# EAGLE design Main (EAGLE 8.3.0)
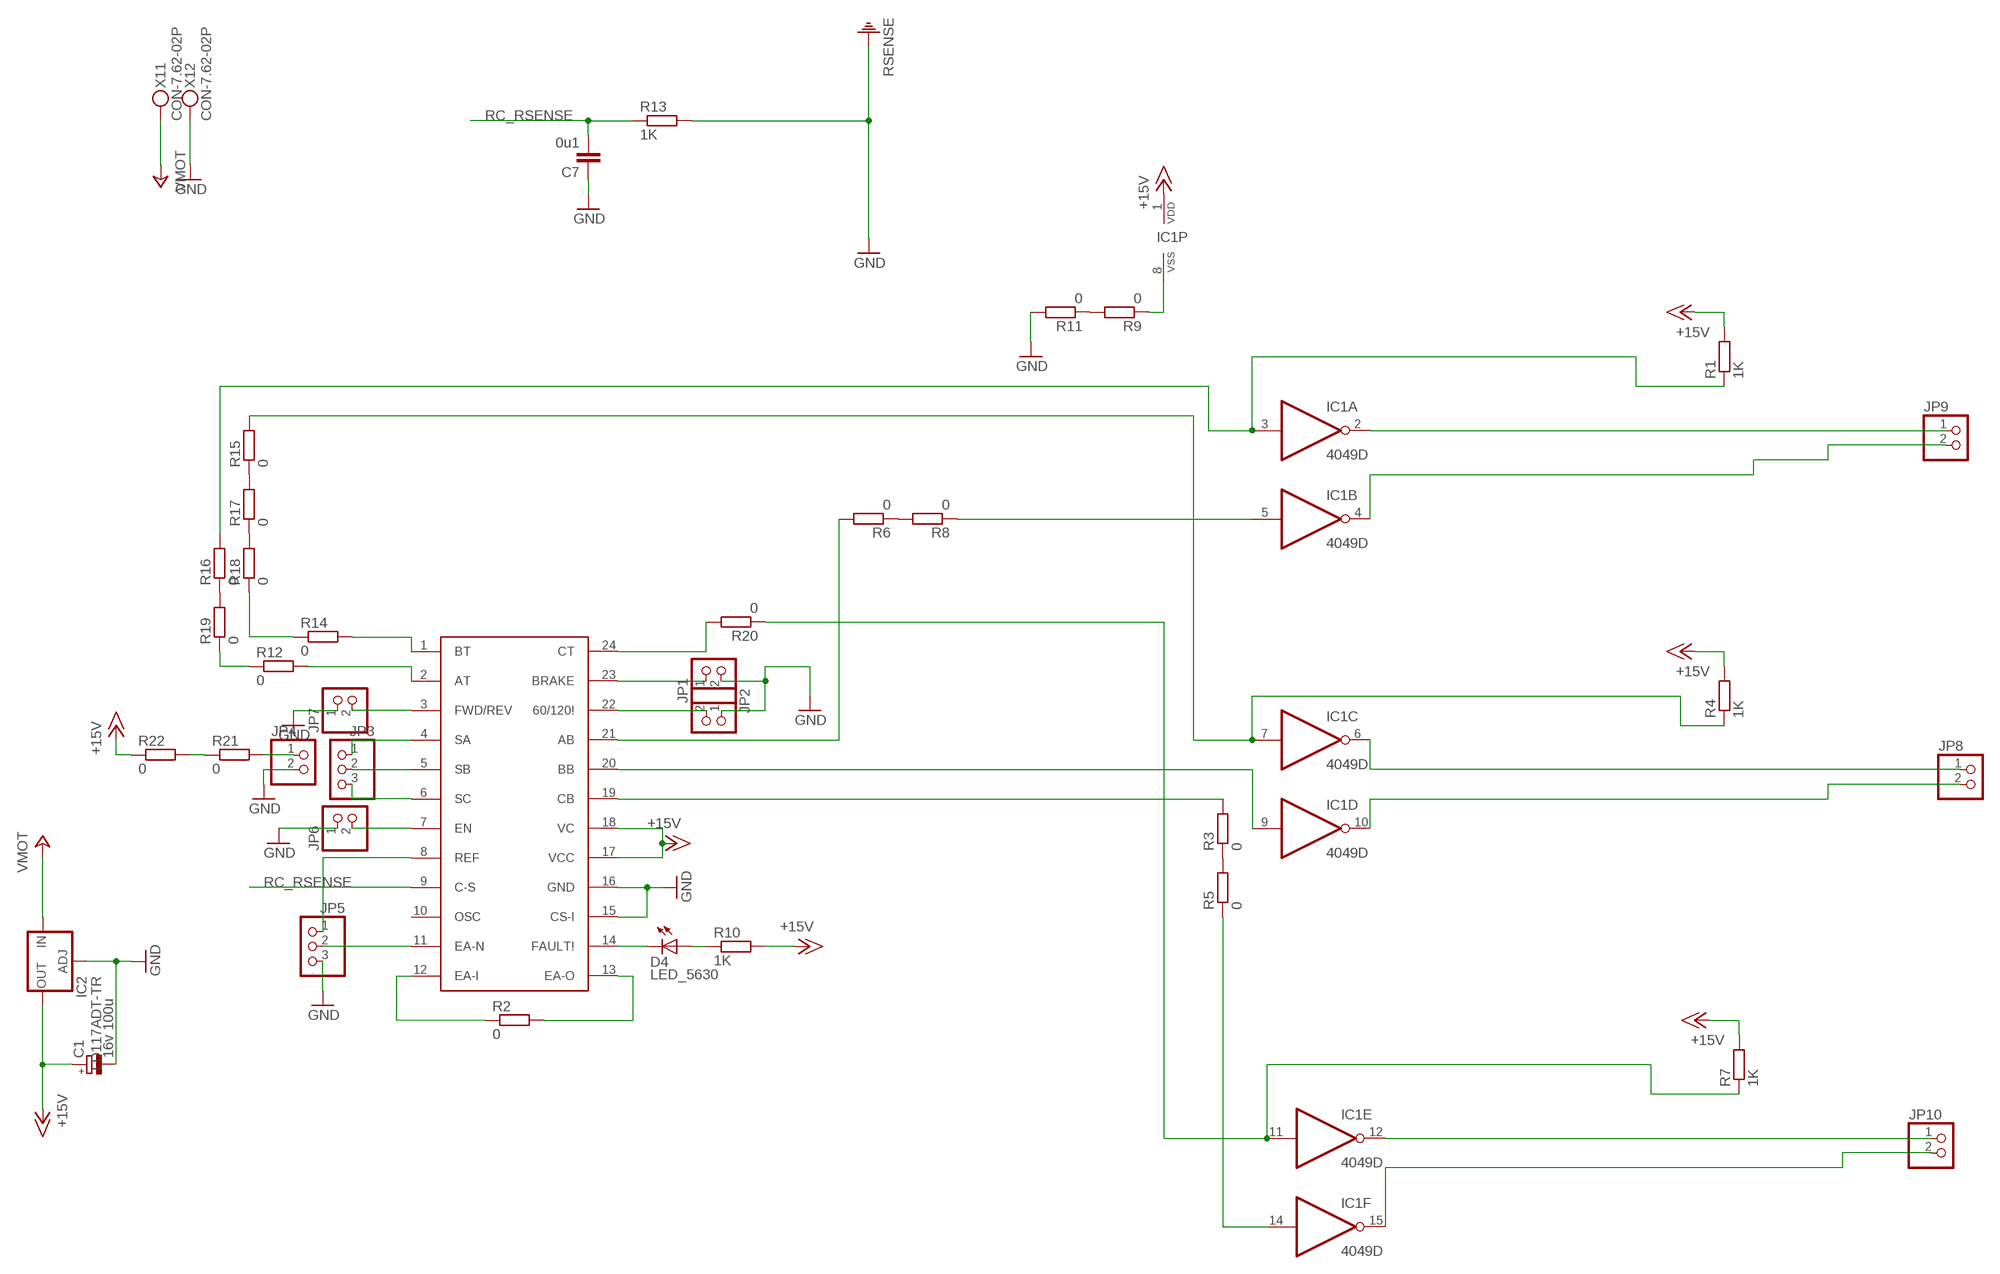
[diagram p0: schematic, sheet 1]

## Parts
C1  16v 100u  CPOL-EUE2.5-7  [E2,5-7]
C7  0u1  CAP_0805  [C0805]
D4  LED_5630  [LED5730]
IC1  4049D  [SO16]
IC2  LD117ADT-TR  [DPACK]
JP1  PINHD-1X2  [1X02]
JP2  PINHD-1X2  [1X02]
JP3  PINHD-1X3  [1X03]
JP4  PINHD-1X2  [1X02]
JP5  PINHD-1X3  [1X03]
JP6  PINHD-1X2  [1X02]
JP7  PINHD-1X2  [1X02]
JP8  PINHD-1X2  [1X02]
JP9  PINHD-1X2  [1X02]
JP10  PINHD-1X2  [1X02]
R1  1K  R_0805  [R0805]
R2  0  R_0805  [R0805]
R3  0  R_0805  [R0805]
R4  1K  R_0805  [R0805]
R5  0  R_0805  [R0805]
R6  0  R_0805  [R0805]
R7  1K  R_0805  [R0805]
R8  0  R_0805  [R0805]
R9  0  R_1206  [R1206]
R10  1K  R_0805  [R0805]
R11  0  R_0805  [R0805]
R12  0  R_0805  [R0805]
R13  1K  R_0805  [R0805]
R14  0  R_0805  [R0805]
R15  0  R_0805  [R0805]
R16  0  R_0805  [R0805]
R17  0  R_0805  [R0805]
R18  0  R_0805  [R0805]
R19  0  R_0805  [R0805]
R20  0  R_0805  [R0805]
R21  0  R_0805  [R0805]
R22  0  R_0805  [R0805]
U$1  IC-MC33035-D  [SO24W]
X1  CON-7.62-02P  [KF25C-7.62-02P-13]

## Nets
+15V: C1.+ IC1.1(P:VDD) IC2.4(OUT) R1.2 R4.2 R7.2 R10.2 R22.1 U$1.17(VCC) U$1.18(VC)
+24V: IC2.3(IN) X1.P$1 ; supply symbol labelled VMOT
GND: C1.- C7.1 IC2.1(ADJ) JP1.2 JP2.1 JP4.2 JP5.3 JP6.1 JP7.1 R11.2 R13.2 U$1.15(CS-I) U$1.16(GND) X1.P$2 ; supply symbol labelled RSENSE
N$1: R2.2 U$1.13(EA-O)
N$2: IC1.14(F:I) R5.1
N$3: IC1.2(A:O) JP9.1
N$4: IC1.4(B:O) JP9.2
N$5: R3.1 R5.2
N$6: R6.1 R8.2
N$7: IC1.5(B:I) R8.1
N$8: R9.2 R11.1
N$9: IC1.6(C:O) JP8.1
N$10: IC1.10(D:O) JP8.2
N$11: IC1.8(P:VSS) R9.1
N$12: R14.2 U$1.1(BT)
N$13: R12.2 U$1.2(AT)
N$14: R14.1 R18.1
N$15: IC1.12(E:O) JP10.1
N$16: IC1.15(F:O) JP10.2
N$17: R12.1 R19.1
N$18: R15.1 R17.2
N$19: IC1.3(A:I) R1.1 R16.2
N$20: IC1.7(C:I) R4.1 R15.2
N$21: IC1.11(E:I) R7.1 R20.1
N$22: JP1.1 U$1.23(BRAKE)
N$23: JP2.2 U$1.22(60/120!)
N$24: R6.2 U$1.21(AB)
N$25: IC1.9(D:I) U$1.20(BB)
N$26: R3.2 U$1.19(CB)
N$27: R17.1 R18.2
N$28: R16.1 R19.2
N$29: R20.2 U$1.24(CT)
N$30: JP4.1 R21.2
N$31: R21.1 R22.2
N$33: JP3.1 U$1.4(SA)
N$34: JP3.2 U$1.5(SB)
N$35: JP3.3 U$1.6(SC)
N$36: R2.1 U$1.12(EA-I)
N$37: JP5.1 U$1.8(REF)
N$38: JP5.2 U$1.11(EA-N)
N$39: JP6.2 U$1.7(EN)
N$40: JP7.2 U$1.3(FWD/REV)
N$41: D4.C U$1.14(FAULT!)
N$42: D4.A D4.A1(A) R10.1
RC_RSENSE: C7.2 R13.1 U$1.9(C-S)
Unconnected: U$1.10(OSC)

## Library data of the parts
C1 = rcl:CPOL-EU: POLARIZED CAPACITOR, European symbol
C7 = Namenlos:CAP_
D4 = Namenlos:LED_
IC1 = 40xx:4049: Hex inverting BUFFER
IC2 = v-reg:LD117A?*: Low drop fixed and adjustable positive voltage regulators 1 A Source: http://www.st.com/stonline/products/literature/ds/7194/ld1117axx.pdf
JP1 JP2 JP4 JP6-JP10 = pinhead:PINHD-1X2: PIN HEADER
JP3 JP5 = pinhead:PINHD-1X3: PIN HEADER
R1-R22 = Namenlos:R_
U$1 = Namenlos:IC-MC33035-D
X1 = Namenlos:CON-7.62-02P

## Board
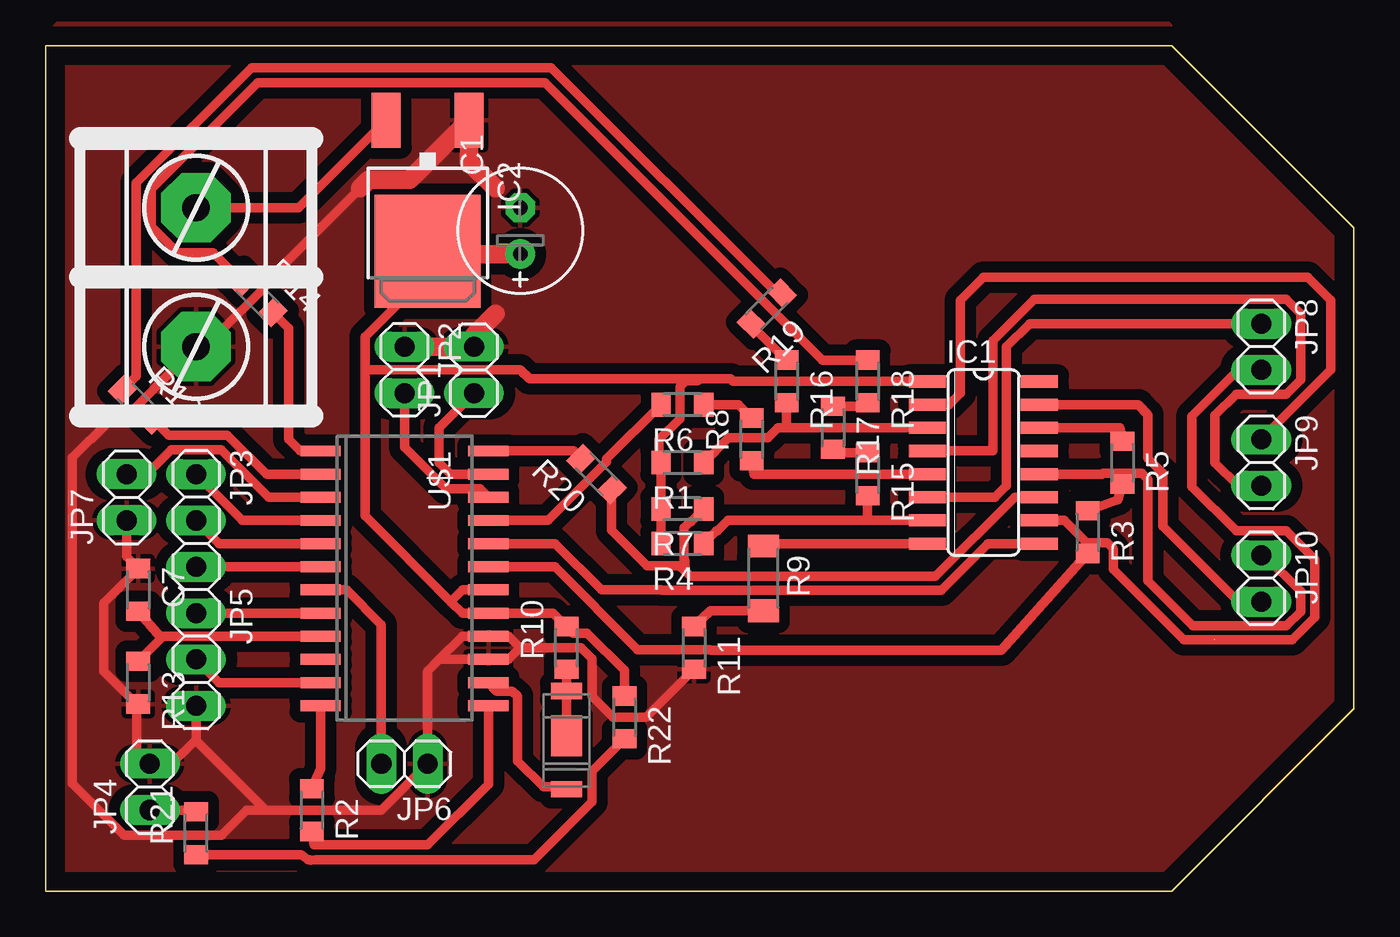
[diagram p1: board, top side]

Size 71.75 x 46.35 mm. Coordinates in mm from the lower left corner, seen from the top.
Outline: 0,46.35 61.75,46.35 71.75,36.35 71.75,10 61.75,0 0,0 0,46.35
Copper layers (1*16): Top 0.035mm / dielectric 1.5mm / Bottom 0.035mm
Design rules "default *": minimum track width 10mil, minimum drill 24mil, track to track 12mil, track to pad 12mil, pad to pad 12mil, via to via 12mil, smd to smd 12mil, copper to edge 40mil, drill to drill 8mil, minimum pad ring 10mil, minimum via ring 8mil, stop-mask expansion 4mil, vias tented up to drill 0mil, thermal gap 10mil

### Footprints (pad centres in the part's own frame; a part is rotated, then mirrored left to right if it is on the bottom)
E2,5-7 = drill 0.813 pad 1.6: + -1.27,0 | drill 0.813 pad 1.6 octagon: - 1.27,0
C0805 = smd 1.05 x 1.3: 1 -1.175,0; 2 1.175,0
LED5730 = smd 0.9 x 1.7: A -2.708,-0.014; C 2.672,-0.014 | smd 2.25 x 1.7: A1 -0.263,-0.014
SO16 = smd 0.66 x 2.032: 1 -4.445,-3.073; 2 -3.175,-3.073; 3 -1.905,-3.073; 4 -0.635,-3.073; 5 0.635,-3.073; 6 1.905,-3.073; 7 3.175,-3.073; 8 4.445,-3.073; 9 4.445,3.073; 10 3.175,3.073; 11 1.905,3.073; 12 0.635,3.073; 13 -0.635,3.073; 14 -1.905,3.073; 15 -3.175,3.073; 16 -4.445,3.073
DPACK = smd 1.6 x 3: 1 -2.28,-4.8; 3 2.28,-4.8 | smd 5.8 x 6.2: 4 0,2.38
1X02 = drill 1.1 long: 1 -1.27,0; 2 1.27,0
1X03 = drill 1.1 long: 1 -2.54,0; 2 0,0; 3 2.54,0
R0805 = smd 1.05 x 1.3: 1 -1.175,0; 2 1.175,0
R1206 = smd 1.25 x 1.7: 1 -1.775,0; 2 1.775,0
SO24W = smd 0.6 x 2.2: 1 -6.985,-4.6; 2 -5.715,-4.6; 3 -4.445,-4.6; 4 -3.175,-4.6; 5 -1.905,-4.6; 6 -0.635,-4.6; 7 0.635,-4.6; 8 1.905,-4.6; 9 3.175,-4.6; 10 4.445,-4.6; 11 5.715,-4.6; 12 6.985,-4.6; 13 6.985,4.6; 14 5.715,4.6; 15 4.445,4.6; 16 3.175,4.6; 17 1.905,4.6; 18 0.635,4.6; 19 -0.635,4.6; 20 -1.905,4.6; 21 -3.175,4.6; 22 -4.445,4.6; 23 -5.715,4.6; 24 -6.985,4.6
KF25C-7.62-02P-13 = drill 1.5 pad 3.81 octagon: P$1 -3.81,0; P$2 3.81,0

### Placement (x,y rotation side)
C1  26.04,36.2 90 top
C7  5.08,16.51 270 top
D4  28.57,8.25 270 top
IC1  51.44,23.49 270 top
IC2  20.95,37.46 180 top
JP1  23.5,28.57 90 top
JP2  19.68,28.57 270 top
JP3  8.25,20.32 270 top
JP4  5.71,5.71 90 top
JP5  8.25,12.7 270 top
JP6  19.68,6.98 180 top
JP7  4.45,21.59 90 top
JP8  66.67,29.84 270 top
JP9  66.67,23.49 270 top
JP10  66.67,17.14 270 top
R1  34.92,23.49 180 top
R2  14.61,4.44 270 top
R3  57.15,19.68 270 top
R4  34.92,19.05 180 top
R5  59.05,23.49 270 top
R6  34.92,26.67 180 top
R7  34.92,20.95 180 top
R8  38.73,24.76 90 top
R9  39.37,17.14 270 top
R10  28.57,13.33 90 top
R11  35.56,13.33 270 top
R12  5.08,26.67 315 top
R13  5.08,11.43 270 top
R14  11.62,32.57 315 top
R15  45.09,22.86 270 top
R16  40.64,27.94 270 top
R17  43.18,25.4 270 top
R18  45.09,27.94 270 top
R19  39.56,31.94 225 top
R20  30.22,22.86 135 top
R21  8.25,3.17 90 top
R22  31.75,9.52 270 top
U$1  19.68,17.14 270 top
X1  8.25,33.66 270 top

### Tracks (layer width: path | path; a pad name or v marks a point on that pad's centre or on a via)
+15V
  Top 0.508: R4.2 R7.2 R1.2 33.66,23.59 33.66,24.76 34.79,25.9 34.79,27.66 35.11,27.98 35.75,27.98 35.84,28.08 | IC2.4 20.95,33.82 17.53,30.4 17.53,28.65 | 17.53,28.65 17.53,20.57 22.23,15.87 | 22.23,15.87 22.86,16.51 U$1.18 | 22.23,15.87 22.86,15.24 U$1.17 27.84,15.24 R10.2 28.94,14.15 29.7,14.15 31.75,12.1 R22.1 | IC1.1 37.7,27.94 37.56,28.08 35.84,28.08 | 35.84,28.08 26.53,28.08 26.04,28.57 17.61,28.57 17.53,28.65
  Top 1.016: 25.99,34.92 C1.+ 21.12,34.92 IC2.4
+24V
  Top 0.508: X1.P$1 13.88,37.46 IC2.3
GND
  Top 0.508: 8.25,8.31 JP5.3 | 8.25,8.31 8.25,8.25 12.07,4.44 | 12.07,4.44 18.41,4.44 JP6.1 20.95,12.06 21.59,12.7 | 26.04,13.33 25.4,13.97 U$1.16 22.86,13.97 21.59,12.7 | 26.04,13.33 25.4,12.7 U$1.15 21.59,12.7 | R13.2 4.98,10.25 | 4.98,10.25 3.17,12.06 3.17,15.78 C7.1 4.45,18.32 JP7.1 | 4.98,10.25 4.98,7.71 JP4.2 6.93,6.98 8.25,8.31 | 9,29.84 X1.P$2 4.18,25.77 3.49,25.77 1.47,23.75 1.47,5.9 4.32,3.06 9.65,3.06 11.04,4.44 12.07,4.44 | 17.24,38.52 12.18,33.45 12.18,33.26 8.76,29.84 8.57,29.84 | 26.04,13.33 29.37,13.33 29.97,12.73 29.97,10.67 31.12,9.52 32.92,9.52 R11.2
  Top 1.016: 17.24,38.52 17.72,39 19.97,39 IC2.1 23.23,39.95 24.67,38.52 | X1.P$2 8.57,29.84 | 24.67,31.65 23.5,30.48 JP1.2 JP2.1
  pour Top (isolate 0.61): -0.63,0.63 -0.63,46.35 0.63,47.62 61.59,47.62 71.75,36.2 71.75,9.52 61.59,-0.64 0.63,-0.64
N$1
  Top 0.508: U$1.13 24.29,5.87 20.95,2.54 14.73,2.54 R2.2
N$2
  Top 0.508: IC1.14 56.52,25.4 57.15,25.4 58.92,25.4 R5.1
N$3
  Top 0.508: IC1.2 49.53,26.67 50.16,27.3 50.16,32.38 51.44,33.66 69.22,33.66 70.48,32.38 70.48,28.57 JP9.1
N$4
  Top 0.508: IC1.4 51.94,24.13 51.94,30.16 54.23,32.45 68.05,32.45 68.83,31.67 68.83,28.02 68.05,27.24 65.3,27.24 64.14,26.08 64.14,23.49 65.41,22.22 JP9.2
N$5
  Top 0.508: R3.1 58.8,21.46 R5.2
N$6
  Top 0.508: R6.1 38.01,26.67 R8.2
N$7
  Top 0.508: IC1.5 38.87,22.86 R8.1
N$8
  Top 0.508: R9.2 36.45,15.37 R11.1
N$9
  Top 0.508: IC1.6 52.07,21.59 52.7,22.22 52.7,29.84 53.98,31.11 JP8.1
N$10  (1 unrouted)
  Top 0.508: 64.08,13.78 68.37,13.78 69.59,15.01 69.59,18.2 68.05,19.75 65.3,19.75 62.87,22.18 62.87,26.03 65.41,28.57 JP8.2 | 64.14,13.78 62.42,13.78 58.56,17.64 58.56,18.77 58.23,19.09 57.11,19.09 55.88,20.32 IC1.10
N$11
  Top 0.508: IC1.8 38.87,19.05 R9.1
N$12
  Top 0.508: U$1.1 13.97,24.13 13.34,24.76 13.34,30.85 R14.2
N$13
  Top 0.508: U$1.2 12.12,22.86 9.97,25.01 6.74,25.01 R12.2
N$14
  Top 0.508: R18.1 42.61,29.11 27.4,44.32 11.63,44.32 5.79,38.49 5.79,36.44 7.23,35 9.19,35 R14.1
N$15
  Top 0.508: JP10.1 66.84,18.41 68.83,16.43 68.83,15.32 68.05,14.54 62.93,14.54 60.46,17.01 60.46,22.58 60.14,22.9 57.97,22.9 57.93,22.86 IC1.12
N$16
  Top 0.508: JP10.2 65.41,15.87 61.28,20 61.28,22.91 60.46,23.73 60.46,26.13 59.92,26.67 IC1.15
N$17
  Top 0.508: R19.1 40.1,32.77 27.73,45.14 11.29,45.14 4.98,38.82 4.98,28.23 R12.1
N$18
  Top 0.508: R15.1 43.37,24.03 R17.2
N$19
  Top 0.508: 40.45,25.4 IC1.3 | 40.45,25.4 40.16,25.4 39.62,24.86 37.46,24.86 R1.1 | R16.2 40.64,25.59 40.45,25.4
N$20
  Top 0.508: IC1.7 45.11,20.32 | R15.2 45.09,20.34 45.11,20.32 | R4.1 36.8,19.75 36.86,19.75 37.43,20.32 45.11,20.32
N$21
  Top 0.508: IC1.11 53.15,21.59 48.81,17.26 35.37,17.26 35.07,17.55 | 31.31,22.03 R20.1 31.05,19.79 32.99,17.84 34.78,17.84 35.07,17.55 | R7.1 35.4,20.26 35.34,20.26 35.02,19.93 35.02,18.17 35.07,18.12 35.07,17.55
N$22
  Top 0.508: U$1.23 22.23,22.86 21.59,23.49 21.59,25.4 JP1.1
N$23
  Top 0.508: U$1.22 23.82,22.05 21.95,22.05 19.68,24.32 JP2.2
N$24
  Top 0.508: R6.2 30.78,23.7 30.78,23.55 27.55,20.32 U$1.21
N$25
  Top 0.508: IC1.9 51.69,19.05 49.13,16.49 33.78,16.49 33.76,16.51 30.48,16.51 27.94,19.05 U$1.20
N$26
  Top 0.508: R3.2 52.43,13.19 36.49,13.19 36.44,13.24 32.48,13.24 27.94,17.78 U$1.19
N$27
  Top 0.508: R17.1 44.89,26.57 R18.2
N$28
  Top 0.508: R19.2 38.73,31.03 R16.1
N$29
  Top 0.508: U$1.24 28.95,24.13 R20.2
N$30
  Top 0.508: JP4.1 8.16,4.44 R21.2
N$31
  Top 0.508: R21.1 14.01,2 14.4,1.73 | 14.4,1.73 14.48,1.73 14.55,1.68 14.81,1.73 26.8,1.73 29.97,4.9 29.97,6.57 R22.2 | 14.4,1.73
N$33
  Top 0.508: U$1.4 10.8,20.32 JP3.1
N$34
  Top 0.508: U$1.5 9.52,19.05 JP3.2
N$35
  Top 0.508: U$1.6 JP3.3
N$36
  Top 0.508: U$1.12 15.09,6.7 R2.1
N$37
  Top 0.508: U$1.8 JP5.1
N$38
  Top 0.508: U$1.11 9.52,11.43 JP5.2
N$39
  Top 0.508: U$1.7 16.51,16.51 18.41,14.6 JP6.2
N$40
  Top 0.508: U$1.3 12.23,21.59 9.63,24.19 6.88,24.19 5.55,22.86 JP7.2
N$41
  Top 0.508: U$1.14 24.75,10.97 25.59,10.97 25.89,10.67 25.89,7.13 27.3,5.71 28.43,5.71 D4.C
N$42
  Top 0.508: D4.A1 D4.A 28.56,12.15 R10.1
RC_RSENSE
  Top 0.508: U$1.9 6.98,13.97 | 6.98,13.97 6.25,13.97 C7.2 | 6.98,13.97 6.45,13.97 R13.1